# Altium schematic sheet FILLER_PCB.SchDoc
size A4; SheetNumber: 1; SheetTotal: 1
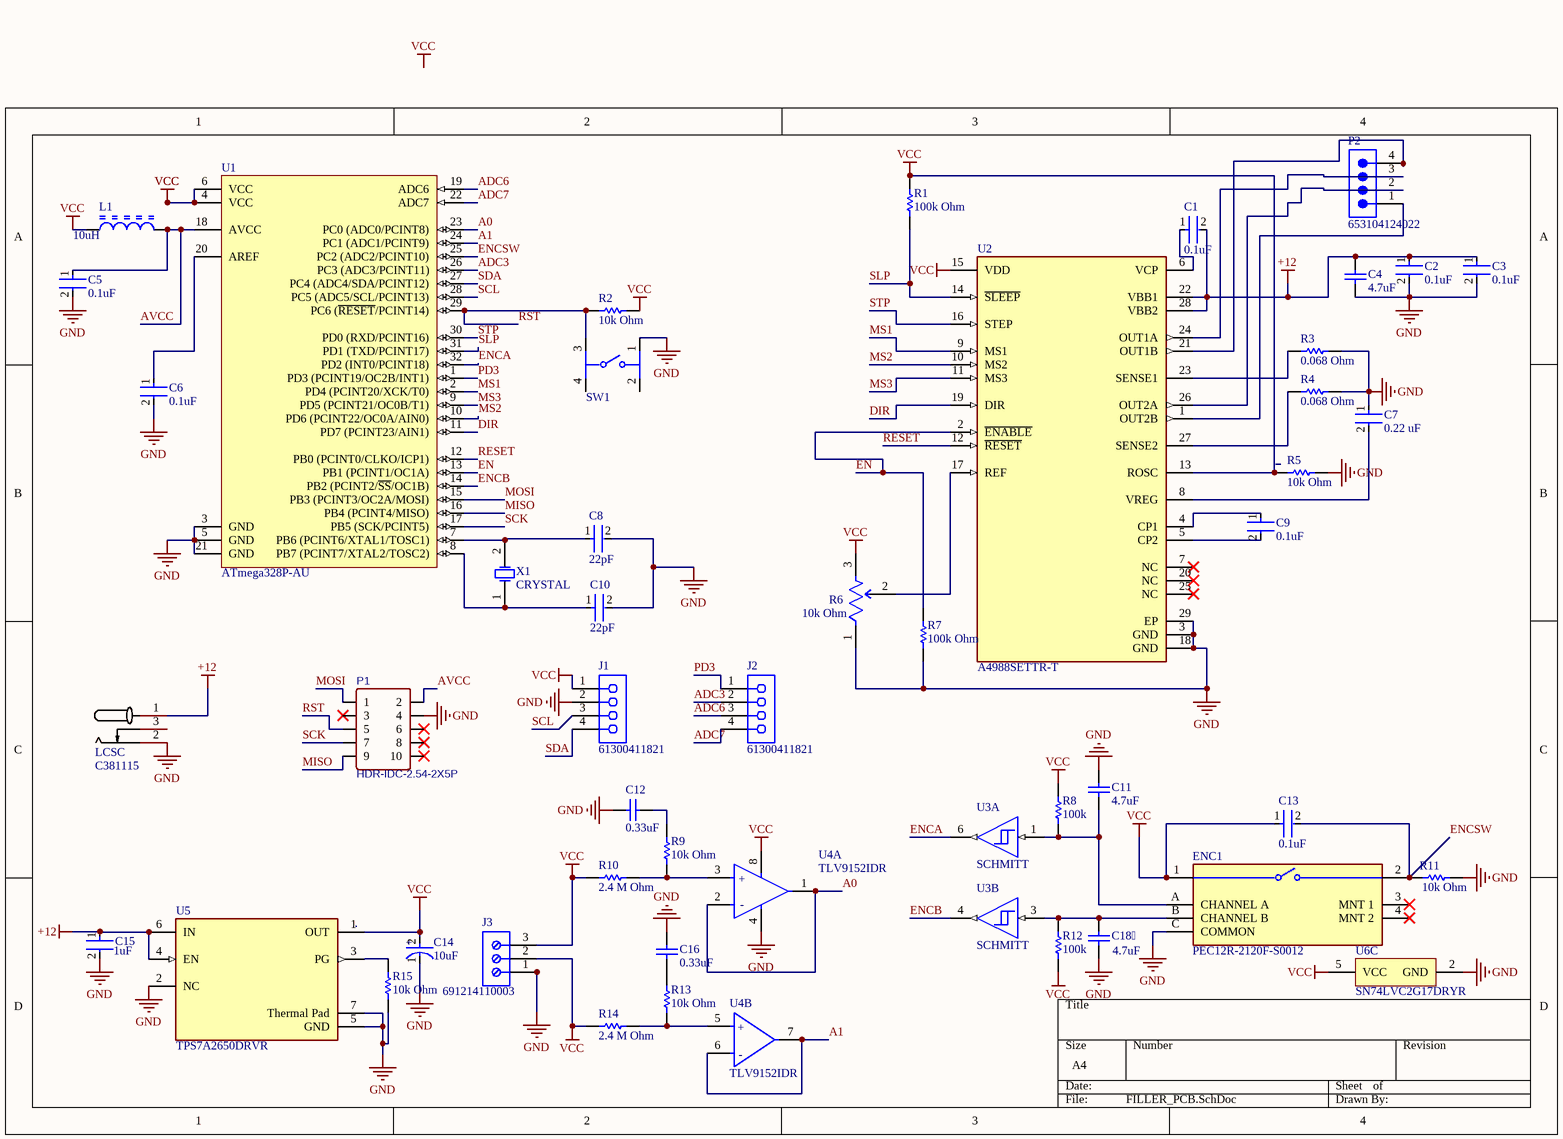
[diagram p0: FILLER_PCB.SchDoc]

## Parts
C1  0.1uF  [FP-GRM033-0_03-MFG]
C2  0.1uF  [FP-GRM033-0_03-MFG]
C3  0.1uF  [FP-GRM033-0_03-MFG]
C4  4.7uF  [CAPC2013X135X45LL10T25]
C5  0.1uF  [FP-GRM033-0_03-MFG]
C6  0.1uF  [FP-GRM033-0_03-MFG]
C7  0.22 uF  [FP-C0805C-DN-MFG]
C8  22pF  [FP-C0603C-CF-MFG]
C9  0.1uF  [FP-GRM033-0_03-MFG]
C10  22pF  [FP-C0603C-CF-MFG]
C11  4.7uF  [CAPC2013X135X45LL10T25]
C12  0.33uF  [CAPC2013X140X50NL20T25]
C13  0.1uF  [FP-GRM033-0_03-MFG]
C14  10uF  [FP-FKB-MFG]
C15  1uF  [FP-GRM155-0_05-IPC_B]
C16  0.33uF  [CAPC2013X140X50NL20T25]
C18  4.7uF  [CAPC2013X135X45LL10T25]
DC1  Supplier 1: LCSC  Supplier Part Number 1: C381115  [DC-IN-TH_DC-005-5A-2.5]  (hidden comment: DC-005-5A-2.5)
ENC1  PEC12R-2120F-S0012  [FP-PEC12R-2120F-S0012-MFG]
J1  61300411821  [61300411821]
J2  61300411821  [61300411821]
J3  691214110003  [691214110003]
L1  10uH  [BOUR-CM322522_V]
P1  HDR-IDC-2.54-2X5P  [HDR-IDC-2.54-2X5P]
P2  653104124022  [653104124022]
R1  100k Ohm  [RESC2013X55X40NL15T20]
R2  10k Ohm  [RESC1005X40X25LL05T05]
R3  0.068 Ohm  [RESC3216X70X50NL05T20]
R4  0.068 Ohm  [RESC3216X70X50NL05T20]
R5  10k Ohm  [RESC1005X40X25LL05T05]
R6  10k Ohm  [FP-TS53YL-MFG]
R7  100k Ohm  [RESC2013X55X40NL15T20]
R8  100k  [RESC2013X55X40NL15T20]
R9  10k Ohm  [RESC1005X40X25LL05T05]
R10  2.4 M Ohm  [RESC1609X50X30LL10T20]
R11  10k Ohm  [RESC1005X40X25LL05T05]
R12  100k  [RESC2013X55X40NL15T20]
R13  10k Ohm  [RESC1005X40X25LL05T05]
R14  2.4 M Ohm  [RESC1609X50X30LL10T20]
R15  10k Ohm  [RESC1005X40X25LL05T05]
SW1  (no value)  [FP-PTS645SM43SMTR92LFS-MFG]
U1  ATmega328P-AU  [32A_M]
U2  A4988SETTR-T  [FP-ET-28-MFG]
U3  SCHMITT  [DRY0006A_V]  (parts A,B of 3)
U4  TLV9152IDR  [FP-D0008A-IPC_A]  (parts A,B of 2)
U5  TPS7A2650DRVR  [FP-DRV0006A-IPC_B]
U6  SN74LVC2G17DRYR  [DRY0006A_V]  (part C of 3)
X1  CRYSTAL  [CTS-ATS-SM-XTAL-2]

## Nets
+12: C1.2 C2.1 C3.1 C4.2 C15.1 DC1.1 U2.22(VBB1) U2.28(VBB2) U5.4(EN) U5.6(IN)
GND: C2.2 C3.2 C4.1 C5.2 C6.2 C7.1 C8.2 C10.2 C11.2 C12.2 C14.1(C) C15.2 C16.2 C18.1 DC1.2 ENC1.C(COMMON) J1.2 J3.1 P1.4 R3.2 R4.2 R5.2 R6.1(a) R7.1 R11.2 R15.2 SW1.1 U1.3(GND) U1.5(GND) U1.21(GND) U2.3(GND) U2.18(GND) U2.29(EP) U4.4(V-) U5.2(NC) U5.5(GND) U5.7(Thermal_Pad) U6.2(GND)
VCC: C13.1 C14.2(A) ENC1.1 J1.1 J3.2 J3.3 L1.1 R1.2 R2.2 R5.1 R6.3(c) R8.2 R10.2 R12.1 R14.2 U1.4(VCC) U1.6(VCC) U2.13(ROSC) U2.15(VDD) U4.8(V+) U5.1(OUT) U6.5(VCC)
A0: U1.23(PC0_(ADC0/PCINT8)) U4.1(OUT1) U4.2(IN1-)
A1: U1.24(PC1_(ADC1/PCINT9)) U4.6(IN2-) U4.7(OUT2)
ADC3: J2.2 U1.26(PC3_(ADC3/PCINT11))
ADC6: J2.3 U1.19(ADC6)
ADC7: J2.4 U1.22(ADC7)
AVCC: C5.1 L1.2 P1.2 U1.18(AVCC)
DIR: U1.11(PD7_(PCINT23/AIN1)) U2.19(DIR)
EN: R7.2 U1.13(PB1_(PCINT1/OC1A)) U2.2(~{ENABLE})
ENCA: U1.32(PD2_(INT0/PCINT18)) U3.6(1Y)
ENCB: U1.14(PB2_(PCINT2/~{SS}/OC1B)) U3.4(2Y)
ENCSW: C13.2 ENC1.2 R11.1 U1.25(PC2_(ADC2/PCINT10))
MISO: P1.9 U1.16(PB4_(PCINT4/MISO))
MOSI: P1.1 U1.15(PB3_(PCINT3/OC2A/MOSI))
MS1: U1.2(PD4_(PCINT20/XCK/T0)) U2.9(MS1)
MS2: U1.10(PD6_(PCINT22/OC0A/AIN0)) U2.10(MS2)
MS3: U1.9(PD5_(PCINT21/OC0B/T1)) U2.11(MS3)
PD3: J2.1 U1.1(PD3_(PCINT19/OC2B/INT1))
RESET: U1.12(PB0_(PCINT0/CLKO/ICP1)) U2.12(~{RESET})
RST: P1.5 R2.1 SW1.3 U1.29(PC6_(~{RESET}/PCINT14))
SCK: P1.7 U1.17(PB5_(SCK/PCINT5))
SCL: J1.3 U1.28(PC5_(ADC5/SCL/PCINT13))
SDA: J1.4 U1.27(PC4_(ADC4/SDA/PCINT12))
SLP: R1.1 U1.31(PD1_(TXD/PCINT17)) U2.14(~{SLEEP})
STP: U1.30(PD0_(RXD/PCINT16)) U2.16(STEP)
NetC1_1: C1.1 U2.6(VCP)
NetC6_1: C6.1 U1.20(AREF)
NetC7_2: C7.2 U2.8(VREG)
NetC8_1: C8.1 U1.7(PB6_(PCINT6/XTAL1/TOSC1)) X1.2(X2)
NetC9_1: C9.1 U2.4(CP1)
NetC9_2: C9.2 U2.5(CP2)
NetC10_1: C10.1 U1.8(PB7_(PCINT7/XTAL2/TOSC2)) X1.1(X1)
NetC11_1: C11.1 ENC1.A(CHANNEL_A) R8.1 U3.1(1A)
NetC12_1: C12.1 R9.2
NetC16_1: C16.1 R13.2
NetC18_2: C18.2 ENC1.B(CHANNEL_B) R12.2 U3.3(2A)
NetP2_1: P2.1 U2.1(OUT2B)
NetP2_2: P2.2 U2.26(OUT2A)
NetP2_3: P2.3 U2.24(OUT1A)
NetP2_4: P2.4 U2.21(OUT1B)
NetR3_1: R3.1 U2.23(SENSE1)
NetR4_1: R4.1 U2.27(SENSE2)
NetR6_2: R6.2(b) U2.17(REF)
NetR9_1: R9.1 R10.1 U4.3(IN1+)
NetR13_1: R13.1 R14.1 U4.5(IN2+)
NetR15_1: R15.1 U5.3(PG)

Not connected (* = marked no-connect by the designer): DC1 3; ENC1 3(MNT_1)* 4(MNT_2)*; P1 3* 6* 8* 10*; SW1 2 4; U2 7(NC)* 20(NC)* 25(NC)*

## Notes on the sheet
- Labels drawn without touching a wire or pin: VCC
- (in symbol CMP-04895-000148-1, part A) +; -
- (in symbol CMP-04895-000148-1, part B) +; -
- (in symbol CMP-05427-000100-1) +

## Library data of the parts
C1-C3 C5 C6 C9 C13 = CMP-06035-000062-2: Chip Multilayer Ceramic Capacitors for General Purpose, 0201, 0.10uF, X5R, 15%, 10%, 6.3V; Capacitance: 100nF; Min Operating Temperature: -55°C; Lead Free: Lead Free; Radiation Hardening: No; Dielectric: X5R; Voltage Rating (DC): 6.3V; REACH SVHC: No SVHC; Case/Package: 0201; Voltage Rating: 6.3V; Length: 0.6mm; Max Operating Temperature: 85°C; Width: 0.012inch; Depth: 0.3mm; Material: Ceramic; Case Code (Metric): 0603; Thickness: 0.013inch; Packaging: Tape and Reel; Height: 0.3mm; Weight: 6E-06oz; Package Quantity: 1; Mount: Surface Mount; Voltage: 6.3V; Case Code (Imperial): 0201; Tolerance: 10%; Termination: SMD/SMT
C4 C11 C18 = CMP-1662-00015-2: Chip Capacitor, 4.7 uF, +/- 10%, 16 V, -55 to 85 degC, 0805 (2012 Metric), RoHS, Tape and Reel; PartNumber: GRM21BR61C475KA88L; Voltage Rating (DC): 16 V; Type (Capacitors): X5R; Case\/Package: 0805; Pins: 2; DatasheetVersion: 03/2016; REACH SVHC: No SVHC; Tolerance: 10%; Width: 1.25 mm; Capacitance: 4.7 uF; Mount: Surface Mount; ComponentLink1Description: Manufacturer URL; Case Code (Metric): 2012; PackageDescription: 2-Pin Surface Mount Device, Body 2 x 1.25 mm; Height: 1.25 mm; Voltage Rating: 16 V; Max Operating Temperature: 85 degC; RoHSCompliant: true; Length: 2 mm; ComponentLink1URL: http://www.murata.com/; Mounting Technology: Surface Mount; Packaging: Tape and Reel; Min Operating Temperature: -55 degC; ComponentLink2Description: Datasheet; Case Code (Imperial): 0805; Radiation Hardening: No; Package Quantity: 3000; PackageReference: 0805; ComponentLink2URL: http://search.murata.co.jp/Ceramy/image/img/A01X/G101/ENG/GRM21BR61C475KA88-01.pdf
C7 = CMP-1036-04552-2: CAP CER 0.22UF 50V X7R 0805; Manufacturer: KEMET; Manufacturer Part Number: C0805C224K5RACTU; Value: 0.22 μF; Temperature Coefficient: 30ppm/°C; Material: Ceramic; Tolerance: 0.1; ComponentLink2URL: https://content.kemet.com/datasheets/KEM_C1003_C0G_SMD.pdf; Temperature Characteristic: X7R; Device Class L3: Ceramic Capacitors; Lead Free: Yes; Temperature: -55°C to +125°C; RoHS: TRUE; Capacitance: 0.22 μF; Automotive: No; Octopart: https://octopart.com/c0805c224k5ractu-kemet-144670; Temperature Range Low: -55°C; Height: 0.88mm; Device Class L1: Passive Components; Digikey Description: CAP CER 0.22UF 50V X7R 0805; ComponentLink2Description: Datasheet; Mouser Description: CAP CER 0.22UF 50V X7R 0805; Category: Cap; Ipc Land Pattern Name: CAPC200125X78; Temperature Range High: +125°C; Package: C0805C-DN; Device Class L2: Capacitors; Voltage Rating: 50 V
C8 C10 = CMP-2006-03119-3: Cap Ceramic 22pF 50V C0G 5% SMD 0603 125°C Paper T/R; Manufacturer Part Number: C0603C220J5GACTU; Manufacturer: KEMET; Temperature Coefficient: 30ppm/°C; Automotive Grade: Grade 1; Tolerance: 0.05; RoHS: TRUE; Temperature Characteristic: C0G; Capacitance: 22 pF; Device Class L3: Ceramic Capacitors; Digikey Description: Cap Ceramic 22pF 50V C0G 5% SMD 0603 125°C Paper T/R; ComponentLink2URL: https://api.kemet.com/component-edge/download/datasheet/C0603C100J5GACAUTO.pdf; ComponentLink2Description: Datasheet; Automotive: Yes; Temperature: -55°C to +125°C; Temperature Range High: +125°C; Package: C0603C-CF; Device Class L1: Passive Components; Device Class L2: Capacitors; Lead Free: Yes; Value: 22 pF; Category: Cap; Mouser Description: Cap Ceramic 22pF 50V C0G 5% SMD 0603 125°C Paper T/R; Voltage Rating: 50 V; Height: 0.87mm; Material: Ceramic; Temperature Range Low: -55°C; Octopart: https://octopart.com/c0603c220j5gactu-kemet-98525
C12 C16 = CMP-2007-04712-1: Part Number: 0805YC334JAT2A; Manufacturer: AVX Interconnect / Elco
C14 = CMP-05427-000100-1: CAP ALUM 10UF 20% 16V SMD; Ripple Current (AC): 90mA; Polarity: Polar; Dielectric Material: Aluminium; ESR (Equivalent Series Resistance): 1.35R; Leakage Current: 3uA; Life (Hours): 2000Hour; Number of Pins: 2; Package Quantity: 2000; Capacitance: 10uF; Termination: SMD/SMT; Diameter: 4mm; Max Operating Temperature: 105°C; Contact Plating: Tin; Mount: Surface Mount; Construction: Cylindrical; Voltage Rating (DC): 16V; Length: 5.8mm; Voltage: 16V; Ripple Current: 90mA; Packaging: Tape and Reel; Tolerance: 20%; Series: FK; Height: 5.8mm; Width: 5.5mm; Min Operating Temperature: -55°C; Lead Free: Lead Free; Impedance: 1.35R; REACH SVHC: No SVHC; Case/Package: Radial; Radiation Hardening: No; Height - Seated (Max): 0.24inch; Voltage Rating: 16V; RoHS Compliant: Yes
C15 = CMP-2008-04581-2: Chip Multilayer Ceramic Capacitors for General Purpose, 0402, 1.0uF, X5R, 15%, 10%, 25V; Height: 0.5mm; Voltage: 25V; Tolerance: 10%; Termination: SMD/SMT; Dielectric: X5R; REACH SVHC: No SVHC; Case Code (Imperial): 0402; Max Operating Temperature: 85°C; Lead Free: Lead Free; Case/Package: 0402; Mount: Surface Mount; Width: 0.5mm; Weight: 0.000212oz; Min Operating Temperature: -55°C; Voltage Rating (DC): 25V; Length: 1mm; Thickness: 0.022inch; Voltage Rating: 25V; Material: Ceramic; Case Code (Metric): 1005; Package Quantity: 10000; Packaging: Tape and Reel; Depth: 0.5mm; Capacitance: 1uF
DC1 = DC-005-5A-2.5_1: DC Power Receptacle 260℃ Brass -20℃~+70℃ 2.5mm 6.5mm 5A 24V Plugin DC Power Connectors ROHS; Manufacturer: XKB Connectivity(中国星坤); Add into BOM: yes; Symbol: DC-005-5A-2.5; Device: DC-005-5A-2.5; LCSC Part Name: DC电源插座 内径:2.5mm 外径:6.5mm; Supplier Part: C381115; Manufacturer Part: DC-005-5A-2.5; Supplier Footprint: 插件; JLCPCB Part Class: Extended Part; Datasheet: https://atta.szlcsc.com/upload/public/pdf/source/20220930/9F6B678D272419D8FE16D336E354A545.pdf; Supplier: LCSC; Convert to PCB: yes; Connector Type: DC Power Receptacle; Inside Contact Diameter: 2.5mm; Outside Contact Diameter: 6.5mm; Current Rating (Max): 5A; Voltage Rating (Max): 24V; Contact Material: Brass; Operating Temperature Range: -20℃~+70℃; Soldering Temperature(Max): 260℃
ENC1 = CMP-07421-000025-1: ROTARY ENCODER MECHANICAL 12PPR; Pulses per Revolution: 12; Hole Diameter: 2.1mm; Output Type: Quadrature; Built in Switch: Yes; Number of Channels: 2; Termination: PC Pin; Encoder Type: Mechanical; Package Quantity: 75; Height: 13.4mm; Max Operating Temperature: 70°C; Series: PEC12R; RoHS Compliant: Yes; Orientation: Right Angle; Length: 26mm; Width: 12.5mm; Mount: Through Hole; Packaging: Bulk; Detent: Yes; Min Operating Temperature: -30°C
J1 J2 = CMP-1502-01316-3: NexarPartId: 61924712; Contact Resistance: 20mΩ; Gender: Female; Current Rating: 3A; Operating Supply Voltage: 250V; RoHS: Non-Compliant; Number of Pins: 4; Orientation: Vertical; Lead Pitch: 2.54mm
J3 = CMP-1502-02466-2: NexarPartId: 18818289; Number of Levels: 1; Voltage: 300V; Pitch: 3.5052mm; Stripping Length: -6mm; Number of Positions Per Level: 3; Plating: Brass, Steel; Wire/Cable Gauge: 24AWG; Wire Gauge (Min): 16AWG; Current Rating: 10A; Width: 10.9mm; Length: 7.4mm; Housing Material: Nylon; Height: 12.2mm; Min Operating Temperature: -40°C; Contact Plating: Brass, Tin; Packaging: Box; Color: Blue, Green; Number of Contacts: 3; Number of Pins: 3; Voltage Rating: 300V; Termination: Screw; Lead Pitch: 3.5mm; Max Operating Temperature: 105°C; Mount: Through Hole; Contact Material: Brass; RoHS: Compliant; Wire Gauge (Max): 24AWG; Current: 10A; REACH SVHC: Unknown
L1 = CMP-1747-00008-1: Chip Inductor / , 10 uH, +/- 10%, -40 to 125 degC, 1210 (3225 Metric), RoHS, Tape and Reel; Current Rating: 1.5 A; Colour: White; Gender: Female; Connector Type: USB; Min Operating Temperature: -55 degC; ComponentLink2Description: Datasheet; Packaging: Tray; Contact Material: Bronze; ComponentLink1Description: Manufacturer URL; PackageDescription: 2-Pin Surface Mount Device, Body 3.2 x 2.5 mm; Contact Plating: Gold; Max Operating Temperature: 85 degC; ComponentLink2URL: http://www.bourns.com/docs/Product-Datasheets/cm322522.pdf; PackageReference: 1210; Radiation Hardening: No; DatasheetVersion: Aug-14; Package Quantity: 100; Pins: 4; Mount: Through Hole; Lead Pitch: 2.5 mm; ComponentLink1URL: http://www.bourns.com/; Height: 15.9 mm; RoHSCompliant: true; Width: 11.15 mm
P1 = HDR-IDC-2.54-2X5P: Manufacturer: BOOMELE(博穆精密); Manufacturer Part: 2.54-2*5P简牛; Supplier: LCSC; Supplier Part: C5665; JLCPCB Part Class: Extended Part; spicePre: P; spiceSymbolName: HDR-IDC-2.54-2X5P
P2 = CMP-1502-00759-2: NexarPartId: 18818277; Insulation: Insulated; Gender: Male; Number of Positions: 4; Insulation Resistance: 100MΩ; Voltage Rating: 125V; Connector Type: Male Pin; Current Rating: 1A; Pitch: 1.25mm; Contact Resistance: 20mΩ; Housing Material: Nylon; Number of Pins: 4; Mount: Surface Mount; Width: 9.75mm; Flammability Rating: UL94 V-0; Max Operating Temperature: 85°C; Contact Gender: Male; Orientation: Vertical; Contact Mating Length: 2.159mm; REACH SVHC: Unknown; Operating Supply Voltage: 125V; Height: 4.75mm; Contact Material: Copper; Min Operating Temperature: -40°C; Length: 9.75mm; Lead Pitch: 1.25mm; Contact Plating: Tin; Number of Contacts: 4; Termination: SMD/SMT; Color: Beige, White; RoHS: Compliant; Number of Rows: 1; Packaging: Tape and Reel
R1 R7 R8 R12 = CMP-2001-04708-1: Part Number: TNPW0805100KDEEA; Manufacturer: Vishay Dale
R2 R5 R9 R11 R13 R15 = CMP-2000-07588-1: Chip Resistor, 10 KOhm, +/- 1%, 0.1 W, -55 to 155 degC, 0402 (1005 Metric), RoHS, Tape and Reel; Manufacturer: Panasonic; Power Rating: 100mW; Voltage Rating: 50V; Resistance: 10KOhm; Case\/Package: 0402; Temperature Coefficient: 100ppm\/degreesC; RoHSCompliant: True; Lead Free: LeadFree; Package Quantity: 1; Contact Plating: Tin; Length: 1mm; Radiation Hardening: No; REACH SVHC: NoSVHC; Max Operating Temperature: 155degC; Depth: 0.5mm; Case Code (Imperial): 0402; Military Standard: Not; Package Description: 2-Pin Surface Mount Device, Body 1 x 0.5 mm; Termination: SMD/SMT; Case Code (Metric): 1005; Height: 0.35mm; Packaging: TapeandReel; Voltage Rating (DC): 50V; Package Reference: 402; Number of Pins: 2; Tolerance: 1%; Mounting Technology: SurfaceMount; Width: 0.02inch; Mount: SurfaceMount; Datasheet URL: https://industrial.panasonic.com/cdbs/www-data/pdf/RDA0000/AOA0000C304.pdf; Composition: ThickFilm; Datasheet Version: 02/2017; Manufacturer URL: http://www.panasonic.com/; Max Power Dissipation: 100mW; Number of Terminations: 2; Min Operating Temperature: -55degC
R3 R4 = CMP-2003-00782-1: Part Number: ERJ8BWFR068V; Manufacturer: Panasonic
R6 = CMP-02410-000004-1: TRIMMER 10K OHM 0.25W GW TOP ADJ; Power Rating: 250mW; Number of Turns: 1; Resistance Tolerance: 20%; Resistance: 10kR; Temperature Coefficient: 100ppm/°C; Mount: Surface Mount; Max Operating Temperature: 125°C; Military Standard: Not; Min Operating Temperature: -55°C; Series: TS53Y; Lead Free: Lead Free; Resistor Type: Cermet; Length: 5mm; Termination: Gull Wing; RoHS Compliant: Yes; Tolerance: 20%; Taper: Linear; Height: 2.7mm; Package Quantity: 1; Width: 5mm; Depth: 6.4mm; Technology: CERMET; Packaging: Tape and Reel; Max Power Dissipation: 250mW; Radiation Hardening: No
R10 R14 = CMP-1012-00890-2: Part Number: CRCW06032M40FKEA; Manufacturer: Vishay Dale
SW1 = CMP-2000-05160-2: SWITCH TACTILE SPST-NO 0.05A 12V; Contact Resistance: 100mR; Throw Configuration: SPST; Illumination Type: Non-Illuminated; Mechanical Life: 100000Cycles; Current Rating: 50mA; Switch Function: Off-Mom; Actuator Length: 0.85mm; Actuator Material: Nylon; Actuator Type: Standard; Operating Force: 160gf; Min Operating Temperature: -20°C; REACH SVHC: No SVHC; Termination: Gull Wing; Case/Package: SMD/SMT; Packaging: Tape and Reel; Mount: Surface Mount; Voltage Rating (DC): 12V; Orientation: Straight; Lead Free: Lead Free; Contact Material: Silver; Color: Black; Max Current Rating: 50mA; Contact Plating: Silver; Depth: 9mm; Package Quantity: 1; Max Voltage Rating (DC): 12V; Length: 6mm; Max Operating Temperature: 60°C
U1 = CMP-0095-00269-2: 8-bit AVR Microcontroller, 32KB Flash, 1KB EEPROM, 2KB SRAM, 32-pin TQFP, Industrial Grade (-40°C to 85°C); PackageDescription: 32-Lead, 7x7x1.0 mm Body, 0.8mm Lead Pitch, Thin Profile Plastic Quad Flat Package (TQFP); DatasheetVersion: revD, May-2011; RevisionNote: DatasheetVersion & PackageVersion updated. URLs added.; ComponentLink1URL: http://www.atmel.com/; ComponentLink2Description: ATmega48A/48PA/88A/88PA/168A/168PA/328/328P Datasheet; Code_JEDEC: MS-026-ABA; ComponentLink1Description: Manufacturer URL; PackageReference: 32A; ComponentLink3Description: ATmega48A/48PA/88A/88PA/168A/168PA/328/328P Summary; ComponentLink2URL: http://www.atmel.com/dyn/resources/prod_documents/doc8271.pdf; PackageVersion: revC, Oct-2010; ComponentLink3URL: http://www.atmel.com/dyn/resources/prod_documents/8271S.pdf
U2 = CMP-1742-00003-2: IC MTR DRVR BIPOLAR 3-5.5V 28QFN; Number of Outputs: 1; Motor Type: Stepper; Output Current: 2A; Min Supply Voltage: 8V; Output Voltage: 35V; Package Quantity: 1; Max Operating Temperature: 85°C; Case/Package: QFN EP; Mount: Surface Mount; Packaging: Tape and Reel; Radiation Hardening: No; REACH SVHC: No SVHC; Min Operating Temperature: -20°C; Max Supply Voltage: 35V; Number of Pins: 28
U3 = CMP-0859-00864-4: Dual Schmitt-Trigger Buffer, DRY0006A, LARGE T&R; Manufacturer: Texas Instruments; Generic Part Number: SN74LVC2G17; ICC @ Nom Voltage(Max)(mA): 0.01; Output Type: CMOS; Output Drive (IOL/IOH)(Max)(mA): 32/-32; F @ Nom Voltage(Max)(Mhz): 150; Input Type: CMOS/TTL; Rating: Catalog; VCC(Min)(V): 1.65; Technology Family: LVC; VCC(Max)(V): 5.5; Logic: True; Sub-Family: Non-Inverting Buffer/Driver; Schmitt Trigger: Yes; Voltage(Nom)(V): 1.8,2.5,3.3,5; tpd @ Nom Voltage(Max)(ns): 9.3,5.7,5.4,4.3; Bits(#): 2; 3-State Output: No; DatasheetVersion: SCES381N; Operating Temperature Range(C): -40 to 125,-40 to 85; PackageReference: DRY0006A
U4 = CMP-04895-000148-1: IC OPAMP GP 2 CIRCUIT 8SOIC
U5 = CMP-04917-000326-1: IC REG LINEAR 5V 500MA 6WSON
U6 = CMP-0859-00864-4: Dual Schmitt-Trigger Buffer, DRY0006A, LARGE T&R; Manufacturer: Texas Instruments; ICC @ Nom Voltage(Max)(mA): 0.01; Output Type: CMOS; Output Drive (IOL/IOH)(Max)(mA): 32/-32; F @ Nom Voltage(Max)(Mhz): 150; Input Type: CMOS/TTL; Rating: Catalog; VCC(Min)(V): 1.65; Technology Family: LVC; VCC(Max)(V): 5.5; Logic: True; Sub-Family: Non-Inverting Buffer/Driver; Schmitt Trigger: Yes; Voltage(Nom)(V): 1.8,2.5,3.3,5; tpd @ Nom Voltage(Max)(ns): 9.3,5.7,5.4,4.3; Bits(#): 2; 3-State Output: No; Generic Part Number: SN74LVC2G17; DatasheetVersion: SCES381N; Operating Temperature Range(C): -40 to 125,-40 to 85; PackageReference: DRY0006A
X1 = CMP-0585-00002-2: ATS-SM Series Quartz Crystal, 16 MHz, -20 to 70 degC, 11.1 x 4.83 x 4.3mm SMD, RoHS, Tape and Reel; PartNumber: ATS16ASM-1; Manufacturer: CTS Corporation; Shunt Capacitance (C0): 7.0 pF Max; Frequency: 16 MHz; Oscillation Mode: Fundamental or 3rd Overtone; Crystal Cut: AT-Cut; ESR Maximum: 40 Ohms; Drive Level (Type): 100 uW; PackageDescription: 2-Pin SMD, Body 11.1 x 4.83 mm, Pitch 8.5 mm; PackageReference: ATS-SM-XTAL-2; ComponentLink1URL: http://www.ctscorp.com/; RoHS: TRUE; ComponentLink1Description: Manufacturer URL; Operating Temperature: -20 to 70 degC; DatasheetVersion: Rev. K; ComponentLink2Description: Datasheet; Packing: Tape and Reel; ComponentLink2URL: http://www.ctscorp.com/components/Datasheets/008-0309-0.pdf; Mounting Technology: Surface Mount; ComponentLink3URL: http://www.ctscorp.com/components/Datasheets/008-0309-0.pdf; ComponentLink3Description: Package Specification